# EasyEDA Pro project ProPrj_大功率电调_2026-08-17.epro, board 大功率电调V1.1
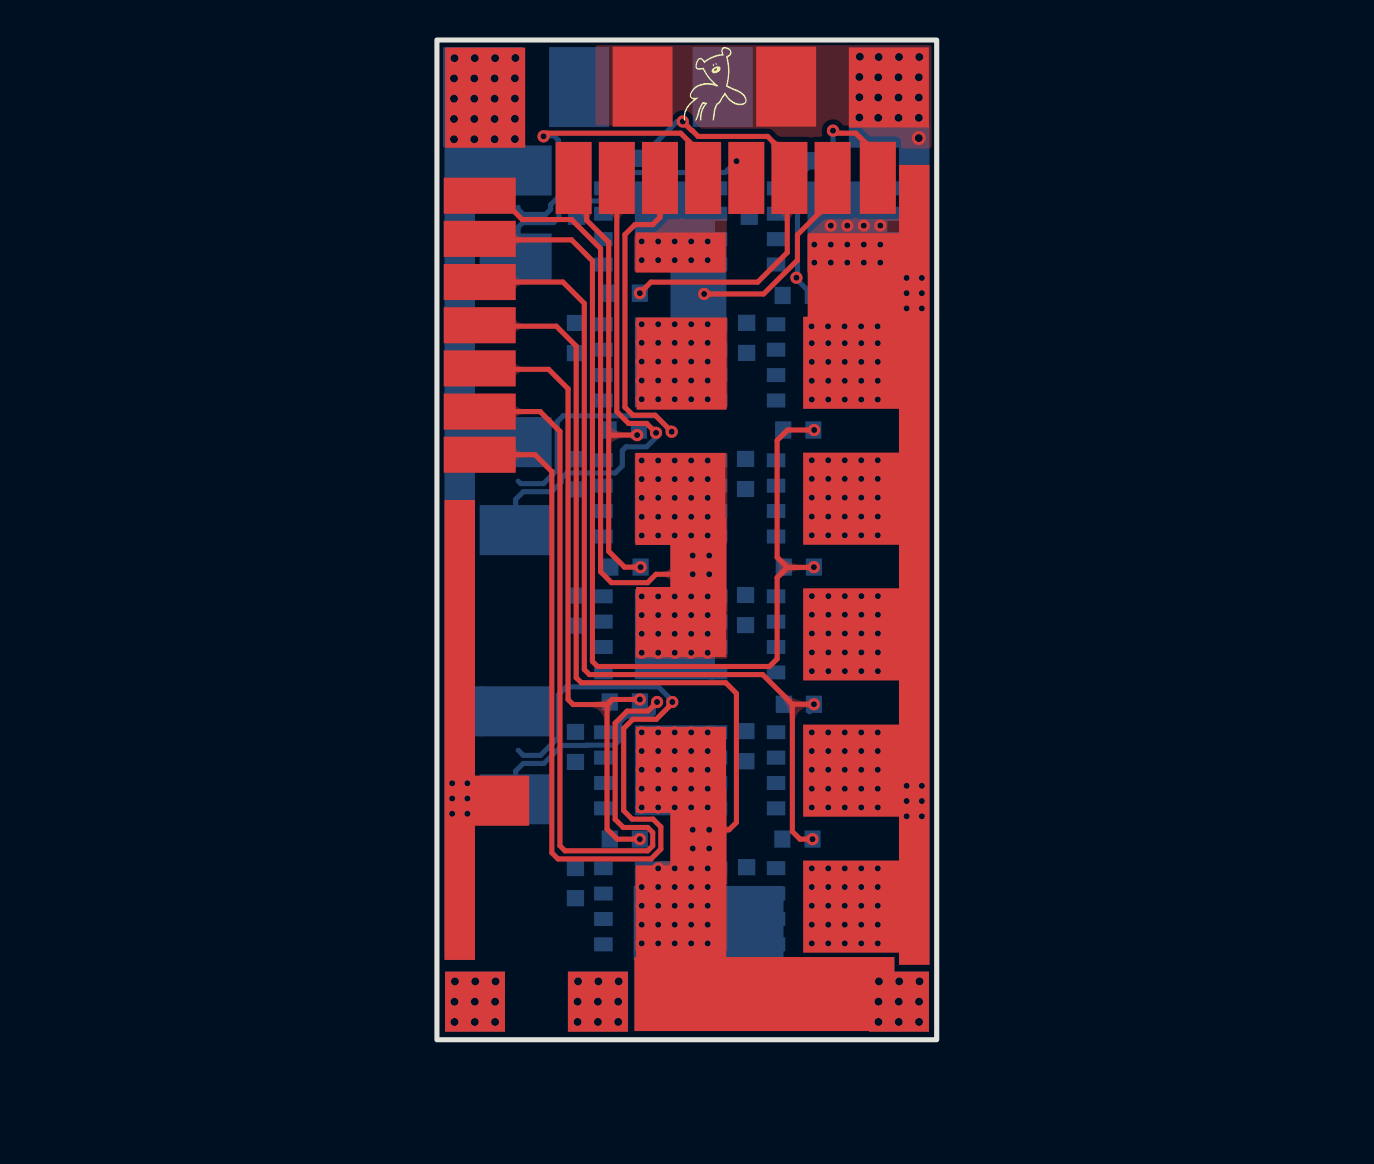
[diagram p19: board, top side]
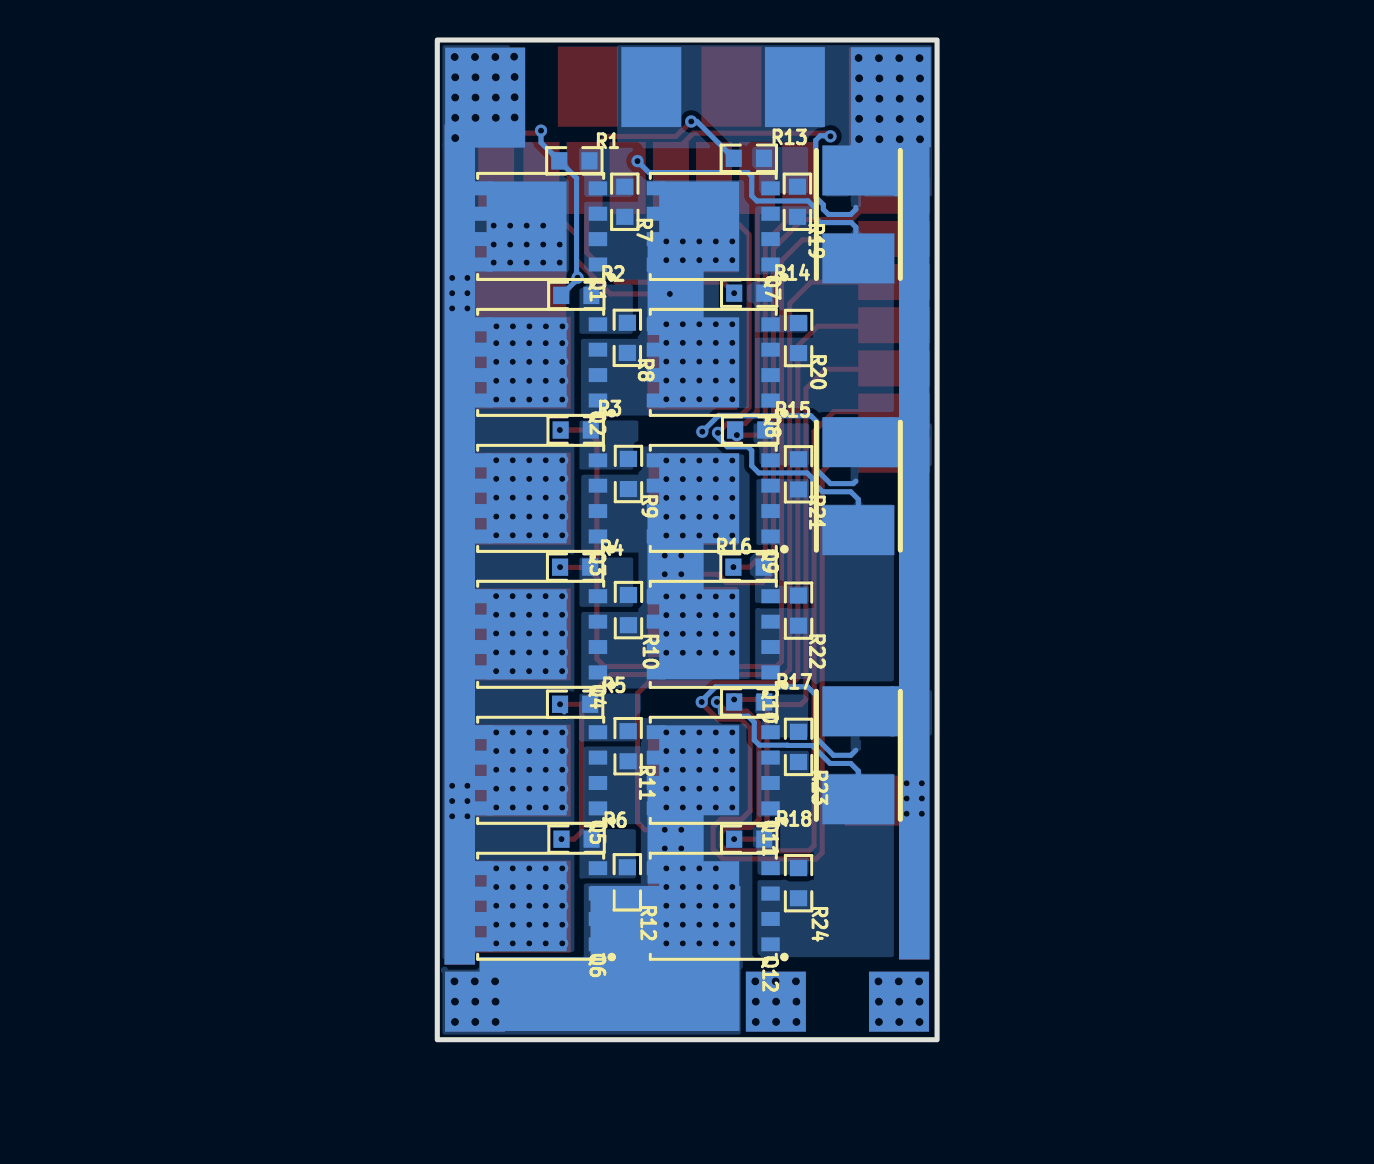
[diagram p20: board, bottom side, seen from below]

Outline 25 x 50 mm; copper layers: Top Layer, Inner1, Inner2, Inner3, Inner4, Bottom Layer. Coordinates in mm from the lower left corner of the outline.
Outline path: rectangle 0,50 25,0
Stack: Top Layer 0.035mm Outer layer thickness 1oz / Dielectric1 0.0994mm 3313 RC57% 4.2mil / Inner1 0.0152mm Inner layer thickness / Dielectric2 0.55mm 0.55mm H/H No copper / Inner2 0.0152mm Inner layer thickness / Dielectric3 0.1088mm 2116 RC54% 4.9mil / Inner3 0.0152mm Inner layer thickness / Dielectric4 0.55mm 0.55mm H/H No copper / Inner4 0.0152mm Inner layer thickness / Dielectric5 0.0994mm 3313 RC57% 4.2mil / Bottom Layer 0.035mm Outer layer thickness 1oz

## Design rules (mm)
spacing copperThickness1oz (default): track to track 0.152, other pairs 0.152 to 0.3
spacing copperThickness2oz: track to track 0.203, other pairs 0.152 to 0.3
track width copperThickness1oz (default): min 0.127, default 0.254, max 2.54
track width copperThickness2oz: min 0.203, default 0.254, max 2.54
differential pair differentialPair (default): width min 0.127, default 0.254, max 2.54; gap min 0.152, default 0.152
net GND uses copperRegion
net VCC_BUS uses copperRegion
net U uses copperRegion
net V uses copperRegion
net GHA uses copperRegion
net SNB uses copperRegion

## Placement (name value [footprint] x y rotation side)
CN7  电源正  [单焊盘_贴片_矩形_2X2_1脚#2]  22.61 47.12 180 bottom
CN8  电源负  [单焊盘_贴片_矩形_2X2_1脚#2]  2.31 47.14 180 bottom
CN9  母线电容正  [单焊盘_贴片_矩形_2X2_1脚]  10.29 47.67 0 top
CN10  母线电容正  [单焊盘_贴片_矩形_2X2_1脚]  17.47 47.67 0 top
CN11  母线电容负  [单焊盘_贴片_矩形_2X2_1脚]  7.11 47.64 180 bottom
CN12  母线电容负  [单焊盘_贴片_矩形_2X2_1脚]  14.3 47.64 180 bottom
NOREF  -  [Pad_e303]  17.63 43.1 270 top
NOREF#2  -  [Pad_e905]  13.08 23.75 180 top
NOREF#3  -  [Pad_e783]  2.41 47.12 180 top
NOREF#4  -  [Pad_e306]  11.16 43.1 270 top
NOREF#5  -  [Pad_e316]  20.9 37.23 180 top
NOREF#6  -  [Pad_e758]  12.22 20.89 180 top
NOREF#7  -  [Pad_e314]  2.14 31.42 180 top
NOREF#8  -  [Pad_e766]  20.72 27.06 180 top
NOREF#9  -  [Pad_e102]  1.14 25.02 0 top
NOREF#10  -  [Pad_e106]  8.06 1.91 0 top
NOREF#11  -  [Pad_e832]  2.14 29.88 0 top
NOREF#12  -  [Pad_e594]  1.14 15.49 0 top
NOREF#13  -  [Pad_e767]  20.72 20.27 180 top
NOREF#14  -  [Pad_e881]  16.38 2.29 90 top
NOREF#15  -  [Pad_e780]  1.91 1.91 180 top
NOREF#16  -  [Pad_e107]  23.11 1.91 0 top
NOREF#17  -  [Pad_e908]  13.08 37.59 180 top
NOREF#18  -  [Pad_e759]  12.19 39.37 180 top
NOREF#19  -  [Pad_e906]  13.08 24.13 180 top
NOREF#20  -  [Pad_e831]  1.91 43.43 0 top
NOREF#21  -  [Pad_e907]  13.08 10.16 180 top
NOREF#22  -  [Pad_e882]  13.08 10.16 180 top
NOREF#23  -  [Pad_e304]  15.48 43.1 270 top
NOREF#24  -  [Pad_e301]  22.06 43.11 270 top
NOREF#25  -  [Pad_e781]  8.05 1.91 180 top
NOREF#26  -  [Pad_e308]  6.84 43.1 270 top
NOREF#27  -  [Pad_e305]  13.32 43.1 270 top
NOREF#28  -  [Pad_e782]  23.11 1.91 180 top
NOREF#29  -  [Pad_e769]  20.72 6.66 180 top
NOREF#30  -  [Pad_e784]  22.61 47.62 180 top
NOREF#31  -  [Pad_e307]  9 43.1 270 top
NOREF#32  -  [Pad_e756]  12.22 6.42 180 top
NOREF#33  -  [Pad_e313]  2.14 33.58 180 top
NOREF#34  -  [Pad_e253]  23.88 24.77 0 top
NOREF#35  -  [Pad_e312]  2.14 35.73 180 top
NOREF#36  -  [Pad_e741]  12.21 13.5 180 top
NOREF#37  -  [Pad_e315]  2.14 29.26 180 top
NOREF#38  -  [Pad_e748]  12.24 33.81 180 top
NOREF#39  -  [Pad_e747]  12.18 27.05 180 top
NOREF#40  -  [Pad_e833]  2.08 16.42 0 top
NOREF#41  -  [Pad_e310]  2.14 40.05 180 top
NOREF#42  -  [Pad_e770]  20.85 39.34 180 top
NOREF#43  -  [Pad_e317]  2.61 11.96 0 top
NOREF#44  -  [Pad_e765]  20.72 33.86 180 top
NOREF#45  -  [Pad_e768]  20.72 13.46 180 top
NOREF#46  -  [Pad_e105]  1.91 1.91 0 top
NOREF#47  -  [Pad_e311]  2.14 37.89 180 top
NOREF#48  -  [Pad_e302]  19.79 43.1 270 top
NOREF#49  -  [Pad_e835]  13.59 5.84 90 top
NOREF#50  -  [Pad_e834]  16.38 2.29 90 top
NOREF#51  -  [Pad_e601]  23.88 23.75 0 top
NOREF#52  -  [Pad_e309]  2.14 42.21 180 top
Q1  BSC035N10NS5  [PG-TDSON-8_L5.2-W5.9-P1.27-LS6.2-BL-EP]  19.83 40.67 90 bottom
Q2  BSC035N10NS5  [PG-TDSON-8_L5.2-W5.9-P1.27-LS6.2-BL-EP]  19.83 33.88 90 bottom
Q3  BSC035N10NS5  [PG-TDSON-8_L5.2-W5.9-P1.27-LS6.2-BL-EP]  19.83 27.08 90 bottom
Q4  BSC035N10NS5  [PG-TDSON-8_L5.2-W5.9-P1.27-LS6.2-BL-EP]  19.83 20.28 90 bottom
Q5  BSC035N10NS5  [PG-TDSON-8_L5.2-W5.9-P1.27-LS6.2-BL-EP]  19.83 13.48 90 bottom
Q6  BSC035N10NS5  [PG-TDSON-8_L5.2-W5.9-P1.27-LS6.2-BL-EP]  19.83 6.68 90 bottom
Q7  BSC035N10NS5  [PG-TDSON-8_L5.2-W5.9-P1.27-LS6.2-BL-EP]  11.19 40.67 90 bottom
Q8  BSC035N10NS5  [PG-TDSON-8_L5.2-W5.9-P1.27-LS6.2-BL-EP]  11.19 33.88 90 bottom
Q9  BSC035N10NS5  [PG-TDSON-8_L5.2-W5.9-P1.27-LS6.2-BL-EP]  11.19 27.08 90 bottom
Q10  BSC035N10NS5  [PG-TDSON-8_L5.2-W5.9-P1.27-LS6.2-BL-EP]  11.19 20.28 90 bottom
Q11  BSC035N10NS5  [PG-TDSON-8_L5.2-W5.9-P1.27-LS6.2-BL-EP]  11.19 13.48 90 bottom
Q12  BSC035N10NS5  [PG-TDSON-8_L5.2-W5.9-P1.27-LS6.2-BL-EP]  11.19 6.68 90 bottom
R1  10  [R0603]  18.15 43.96 0 bottom
R2  10  [R0603]  18.05 37.22 0 bottom
R3  10  [R0603]  18.08 30.49 0 bottom
R4  10  [R0603]  18.1 23.64 0 bottom
R5  10  [R0603]  18.11 16.78 0 bottom
R6  10  [R0603]  18.03 10.03 0 bottom
R7  10K  [R0603]  15.62 41.91 90 bottom
R8  10K  [R0603]  15.49 35.1 90 bottom
R9  10K  [R0603]  15.44 28.3 90 bottom
R10  10K  [R0603]  15.44 21.49 90 bottom
R11  10K  [R0603]  15.45 14.68 90 bottom
R12  10K  [R0603]  15.49 7.87 90 bottom
R13  10  [R0603]  9.42 44.08 0 bottom
R14  10  [R0603]  9.4 37.34 0 bottom
R15  10  [R0603]  9.35 30.49 0 bottom
R16  10  [R0603]  9.43 23.64 0 bottom
R17  10  [R0603]  9.4 16.89 0 bottom
R18  10  [R0603]  9.4 10.03 0 bottom
R19  10K  [R0603]  6.99 41.91 90 bottom
R20  10K  [R0603]  6.93 35.09 90 bottom
R21  10K  [R0603]  6.93 28.28 90 bottom
R22  10K  [R0603]  6.93 21.46 90 bottom
R23  10K  [R0603]  6.93 14.65 90 bottom
R24  10K  [R0603]  6.93 7.83 90 bottom
R25  0.5mΩ  [RES-SMD_L6.4-W3.2_RLP25]  3.94 27.69 270 bottom
R26  0.5mΩ  [RES-SMD_L6.4-W3.2_RLP25]  3.94 14.22 270 bottom
R28  0.5mΩ  [RES-SMD_L6.4-W3.2_RLP25]  3.94 41.28 270 bottom

## Footprints (pads in the part's own frame, mm; a bottom-side part is the same pattern mirrored in y, then rotated)
Pad_e102
  rect 1.524x42 smd far side: 1(0,0)
Pad_e105
  rect 3x3 smd far side: 1(0,0)
Pad_e106
  rect 3x3 smd far side: 1(0,0)
Pad_e107
  rect 3x3 smd far side: 1(0,0)
Pad_e253
  rect 1.524x42 smd far side: 1(0,0)
Pad_e301
  rect 3.6x1.8 smd: 1(0,0)
Pad_e302
  rect 3.6x1.8 smd: 1(0,0)
Pad_e303
  rect 3.6x1.8 smd: 1(0,0)
Pad_e304
  rect 3.6x1.8 smd: 1(0,0)
Pad_e305
  rect 3.6x1.8 smd: 1(0,0)
Pad_e306
  rect 3.6x1.8 smd: 1(0,0)
Pad_e307
  rect 3.6x1.8 smd: 1(0,0)
Pad_e308
  rect 3.6x1.8 smd: 1(0,0)
Pad_e309
  rect 3.6x1.8 smd: 1(0,0)
Pad_e310
  rect 3.6x1.8 smd: 1(0,0)
Pad_e311
  rect 3.6x1.8 smd: 1(0,0)
Pad_e312
  rect 3.6x1.8 smd: 1(0,0)
Pad_e313
  rect 3.6x1.8 smd: 1(0,0)
Pad_e314
  rect 3.6x1.8 smd: 1(0,0)
Pad_e315
  rect 3.6x1.8 smd: 1(0,0)
Pad_e316
  rect 4.7x2.5 smd: 1(0,0)
Pad_e317
  rect 4x2.5 smd: 1(0,0)
Pad_e594
  rect 1.524x23 smd: 1(0,0)
Pad_e601
  rect 1.524x40 smd: 1(0,0)
Pad_e741
  rect 4.5x4.3 smd: 1(0,0)
Pad_e747
  rect 4.5x4.6 smd: 1(0,0)
Pad_e748
  rect 4.5x4.6 smd: 1(0,0)
Pad_e756
  rect 4.5x4.6 smd: 1(0,0)
Pad_e758
  rect 4.5x3.5 smd: 1(0,0)
Pad_e759
  rect 4.5x2 smd: 1(0,0)
Pad_e765
  rect 4.8x4.6 smd: 1(0,0)
Pad_e766
  rect 4.8x4.6 smd: 1(0,0)
Pad_e767
  rect 4.8x4.6 smd: 1(0,0)
Pad_e768
  rect 4.8x4.6 smd: 1(0,0)
Pad_e769
  rect 4.8x4.6 smd: 1(0,0)
Pad_e770
  rect 4.6x2 smd: 1(0,0)
Pad_e780
  rect 3x3 smd: 1(0,0)
Pad_e781
  rect 3x3 smd: 1(0,0)
Pad_e782
  rect 3x3 smd: 1(0,0)
Pad_e783
  rect 4x5 smd: 1(0,0)
Pad_e784
  rect 4x4 smd: 1(0,0)
Pad_e831
  rect 0.5x2.5 smd far side: 1(0,0)
Pad_e832
  rect 0.5x2.5 smd far side: 1(0,0)
Pad_e833
  rect 0.5x2.5 smd far side: 1(0,0)
Pad_e834
  rect 3.7x13 smd far side: 1(0,0)
Pad_e835
  rect 3.7x7.5 smd far side: 1(0,0)
Pad_e881
  rect 3.7x13 smd: 1(0,0)
Pad_e882
  rect 2.8x4.7 smd: 1(0,0)
Pad_e905
  rect 2.8x4.7 smd: 1(0,0)
Pad_e906
  rect 2.8x4.7 smd far side: 1(0,0)
Pad_e907
  rect 2.8x4.7 smd far side: 1(0,0)
Pad_e908
  rect 2.8x4.7 smd far side: 1(0,0)
PG-TDSON-8_L5.2-W5.9-P1.27-LS6.2-BL-EP
  rect 0.7x0.925 smd: 1(-1.905,-2.865) 2(-0.635,-2.865) 3(0.635,-2.865) 4(1.905,-2.865) 5(1.905,2.865) 6(0.635,2.865) 7(-0.635,2.865) 8(-1.905,2.865)
  rect 4.5x4 smd: 9(0.001,0.705)
R0603
  rect 0.806x0.864 smd: 1(-0.753,0) 2(0.753,0)
RES-SMD_L6.4-W3.2_RLP25
  rect 2.5x3.6 smd: 1(-2.2,0) 2(2.2,0)
单焊盘_贴片_矩形_2X2_1脚
  rect 3x4 smd: 1(0,0)
单焊盘_贴片_矩形_2X2_1脚#2
  rect 4x5 smd: 1(0,0)

## Nets
GND: CN8.1 CN11.1 CN12.1 NOREF#3.1 NOREF#9.1 NOREF#11.1 NOREF#12.1 NOREF#20.1 NOREF#40.1 NOREF#43.1 R25.1 R26.1 R28.1
VCC_BUS: CN7.1 CN9.1 CN10.1 NOREF#5.1 NOREF#8.1 NOREF#13.1 NOREF#29.1 NOREF#30.1 NOREF#34.1 NOREF#42.1 NOREF#44.1 NOREF#45.1 NOREF#51.1 Q1.5 Q1.6 Q1.7 Q1.8 Q1.9 Q2.5 Q2.6 Q2.7 Q2.8 Q2.9 Q3.5 Q3.6 Q3.7 Q3.8 Q3.9 Q4.5 Q4.6 Q4.7 Q4.8 Q4.9 Q5.5 Q5.6 Q5.7 Q5.8 Q5.9 Q6.5 Q6.6 Q6.7 Q6.8 Q6.9
GHA: NOREF#24.1 R1.2 R2.2
GHB: NOREF#41.1 R3.2 R4.2
GHC: NOREF#47.1 R5.2 R6.2
GLA: NOREF.1 R13.2 R14.2
GLB: NOREF#26.1 R15.2 R16.2
GLC: NOREF#33.1 R17.2 R18.2
SNA: NOREF#27.1
SNB: NOREF#4.1
SNC: NOREF#37.1
SPA: NOREF#23.1 Q7.1 Q7.2 Q7.3 Q8.1 Q8.2 Q8.3 R19.1 R20.1 R28.2
SPB: NOREF#31.1 Q9.1 Q9.2 Q9.3 Q10.1 Q10.2 Q10.3 R21.1 R22.1 R25.2
SPC: NOREF#7.1 Q11.1 Q11.2 Q11.3 Q12.1 Q12.2 Q12.3 R23.1 R24.1 R26.2
U: NOREF#15.1 NOREF#17.1 NOREF#18.1 NOREF#38.1 NOREF#46.1 NOREF#48.1 Q1.1 Q1.2 Q1.3 Q2.1 Q2.2 Q2.3 Q7.5 Q7.6 Q7.7 Q7.8 Q7.9 Q8.5 Q8.6 Q8.7 Q8.8 Q8.9 R7.1 R8.1
V: NOREF#2.1 NOREF#6.1 NOREF#10.1 NOREF#19.1 NOREF#25.1 NOREF#39.1 NOREF#52.1 Q3.1 Q3.2 Q3.3 Q4.1 Q4.2 Q4.3 Q9.5 Q9.6 Q9.7 Q9.8 Q9.9 Q10.5 Q10.6 Q10.7 Q10.8 Q10.9 R9.1 R10.1
W: NOREF#14.1 NOREF#16.1 NOREF#21.1 NOREF#22.1 NOREF#28.1 NOREF#32.1 NOREF#35.1 NOREF#36.1 NOREF#49.1 NOREF#50.1 Q5.1 Q5.2 Q5.3 Q6.1 Q6.2 Q6.3 Q11.5 Q11.6 Q11.7 Q11.8 Q11.9 Q12.5 Q12.6 Q12.7 Q12.8 Q12.9 R11.1 R12.1
$1N249: Q1.4 R1.1 R7.2
$1N251: Q2.4 R2.1 R8.2
$1N253: Q7.4 R13.1 R19.2
$1N255: Q8.4 R14.1 R20.2
$1N257: Q9.4 R15.1 R21.2
$1N259: Q3.4 R3.1 R9.2
$1N261: Q10.4 R16.1 R22.2
$1N263: Q4.4 R4.1 R10.2
$1N265: Q11.4 R17.1 R23.2
$1N267: Q5.4 R5.1 R11.2
$1N269: Q12.4 R18.1 R24.2
$1N271: Q6.4 R6.1 R12.2

## Via types
v1: diameter 0.7, hole 0.4, Top Layer to Bottom Layer, 64 vias
v2: diameter 0.61, hole 0.305, Top Layer to Bottom Layer, 313 vias

## Routing (per net, layer and track width the routed paths; a pad name or vN(x,y) marks a point on that pad's centre or on a via; arc(x,y) is an arc through that point)
GND:
  vias: v1(0.88,49.09) v1(0.85,48.08) v1(0.85,47.06) v1(0.85,46.05) v1(0.85,45.04) v1(1.89,49.09) v1(1.87,48.08) v1(1.87,47.06) v1(1.87,46.05) v1(1.87,45.04) v1(2.91,49.09) v1(2.88,48.08) v1(2.88,47.06) v1(2.88,46.05) v1(2.88,45.04) v1(3.92,49.1) v1(3.9,48.09) v1(3.9,47.07) v1(3.9,46.06) v1(3.9,45.04) v2(0.76,12.83) v2(0.76,12.06) v2(0.76,11.3) v2(1.52,12.83) v2(1.52,12.06) v2(1.52,11.3)
VCC_BUS:
  vias: v1(21.13,48.15) v1(21.13,47.14) v1(21.13,46.12) v1(21.16,49.16) v1(22.1,49.15) v1(22.07,48.14) v1(22.07,47.12) v1(22.07,46.11) v1(23.11,49.15) v1(23.09,48.14) v1(23.09,47.12) v1(23.09,46.11) v1(24.13,49.15) v1(24.11,48.14) v1(24.11,47.12) v1(24.11,46.11) v1(24.11,45.09) v2(18.74,35.68) v2(18.75,34.84) v2(18.75,33.9) v2(18.75,32.95) v2(18.75,32.02) v2(18.75,28.98) v2(18.75,28.05) v2(18.75,27.11) v2(18.75,26.17) v2(18.75,25.23) v2(18.76,22.19) v2(18.76,21.26) v2(18.76,20.32) v2(18.76,19.37) v2(18.76,18.43) v2(18.75,15.37) v2(18.75,14.44) v2(18.75,13.5) v2(18.75,12.55) v2(18.75,11.62) v2(18.75,8.57) v2(18.75,7.64) v2(18.75,6.7) v2(18.75,5.75) v2(18.75,4.82) v2(18.88,39.77) v2(18.88,38.87) v2(19.57,35.68) v2(19.58,34.84) v2(19.58,33.9) v2(19.58,32.95) v2(19.58,32.02) v2(19.58,28.98) v2(19.58,28.05) v2(19.58,27.11) v2(19.58,26.17) v2(19.58,25.23) v2(19.58,22.19) v2(19.58,21.26) v2(19.58,20.32) v2(19.58,19.37) v2(19.58,18.43) v2(19.58,15.37) v2(19.58,14.44) v2(19.58,13.5) v2(19.58,12.55) v2(19.58,11.62) v2(19.58,8.57) v2(19.58,7.64) v2(19.58,6.7) v2(19.58,5.75) v2(19.58,4.82) v2(19.7,40.72) v2(19.7,39.77) v2(19.7,38.87) v2(20.39,35.68) v2(20.4,34.84) v2(20.4,33.9) v2(20.4,32.95) v2(20.4,32.02) v2(20.4,28.98) v2(20.4,28.05) v2(20.4,27.11) v2(20.4,26.17) v2(20.4,25.23) v2(20.41,22.19) v2(20.41,21.26) v2(20.41,20.32) v2(20.41,19.37) v2(20.41,18.43) v2(20.4,15.37) v2(20.4,14.44) v2(20.4,13.5) v2(20.4,12.55) v2(20.4,11.62) v2(20.4,8.57) v2(20.4,7.64) v2(20.4,6.7) v2(20.4,5.75) v2(20.4,4.82) v2(20.53,40.72) v2(20.53,39.77) v2(20.53,38.87) v2(21.22,35.68) v2(21.23,34.84) v2(21.23,33.9) v2(21.23,32.95) v2(21.23,32.02) v2(21.23,28.98) v2(21.23,28.05) v2(21.23,27.11) v2(21.23,26.17) v2(21.23,25.23) v2(21.23,22.19) v2(21.23,21.26) v2(21.23,20.32) v2(21.23,19.37) v2(21.23,18.43) v2(21.23,15.37) v2(21.23,14.44) v2(21.23,13.5) v2(21.23,12.55) v2(21.23,11.62) v2(21.23,8.57) v2(21.23,7.64) v2(21.23,6.7) v2(21.23,5.75) v2(21.23,4.82) v2(21.35,40.72) v2(21.35,39.77) v2(21.35,38.87) v2(22.04,35.68) v2(22.05,34.84) v2(22.05,33.9) v2(22.05,32.95) v2(22.05,32.02) v2(22.05,28.98) v2(22.05,28.05) v2(22.05,27.11) v2(22.05,26.17) v2(22.05,25.23) v2(22.06,22.19) v2(22.06,21.26) v2(22.06,20.32) v2(22.06,19.37) v2(22.06,18.43) v2(22.05,15.37) v2(22.05,14.44) v2(22.05,13.5) v2(22.05,12.55) v2(22.05,11.62) v2(22.05,8.57) v2(22.05,7.64) v2(22.05,6.7) v2(22.05,5.75) v2(22.05,4.82) v2(22.18,40.72) v2(22.18,39.77) v2(22.18,38.87) v2(23.5,38.1) v2(23.5,37.34) v2(23.5,36.58) v2(23.5,12.7) v2(23.5,11.94) v2(23.5,11.18) v2(24.26,38.1) v2(24.26,37.34) v2(24.26,36.58) v2(24.26,12.7) v2(24.26,11.94) v2(24.26,11.18)
GHA: length 13.2
  Top Layer w0.254: NOREF#24.1 22.06,44.24 20.96,45.34 19.94,45.34 v2(19.81,45.47)
  Bottom Layer w0.254: v2(19.81,45.47) 19.81,44.87 R1.2 18.03,43.09 18.03,38.16 v2(17.98,38.11) 17.98,38.04 R2.2
GHB: length 50.4
  Top Layer w0.254: 17.53,23.62 17.02,23.11 17.02,19.05 16.64,18.67 8.03,18.67 7.78,18.92 7.78,38.96 6.73,40 2.19,40 NOREF#41.1 ; 17.53,23.62 18.84,23.62 v2(18.86,23.64) ; 17.53,23.62 17.02,24.13 17.02,29.97 17.54,30.49 v2(18.87,30.49)
GHC: length 44.2
  Top Layer w0.254: 17.78,16.78 16.3,18.26 7.63,18.26 7.37,18.52 7.37,36.82 6.3,37.89 NOREF#47.1 ; 17.78,16.78 v2(18.86,16.78) ; 17.78,16.78 17.78,10.41 18.16,10.03 v2(18.79,10.03)
  Bottom Layer w0.254: 18.8,16.81 18.65,16.67 18.65,16.4
GLA: length 22
  Top Layer w0.254: v2(12.3,45.92) 12.75,45.47 12.78,45.47 13.06,45.18 16.54,45.18 17.63,44.09 NOREF.1 17.53,42.99 17.53,39.37 16.05,37.89 10.7,37.89 v2(10.15,37.34)
  Bottom Layer w0.254: 10.17,44.08 12.01,45.92 v2(12.3,45.92)
GLB: length 22.7
  Top Layer w0.254: 8.59,30.24 8.59,39.88 7.49,40.98 7.49,42.45 NOREF#26.1 ; 8.59,30.24 8.59,24.43 9.38,23.64 v2(10.19,23.64) ; 8.59,30.24 v2(10.02,30.24)
GLC: length 32.3
  Top Layer w0.254: NOREF#33.1 2.19,33.53 5.59,33.53 6.56,32.56 6.56,17.02 6.81,16.76 8.51,16.76 ; v2(10.15,10.03) 9.02,10.03 8.51,10.54 8.51,16.76 ; 8.51,16.76 8.76,17.02 v2(10.15,17.02)
SNA: length 16
  Top Layer w0.254: v2(5.33,45.18) 5.49,45.34 12.19,45.34 13.32,44.21 NOREF#27.1
  Bottom Layer w0.254: v2(5.33,45.18) 5.36,45.21 5.84,45.21 6.07,44.98 6.07,42.14 5.69,41.76 5.69,41.53 5.44,41.28 4.32,41.28 4.06,41.53 4.06,41.63
SNB: length 26.4
  Top Layer w0.254: NOREF#4.1 11.16,41.13 10.79,40.77 9.91,40.77 9.41,40.27 9.41,31.63 9.8,31.24 10.92,31.24 v2(11.74,30.41)
  Bottom Layer w0.254: v2(11.74,30.41) 10.95,31.2 6.31,31.2 6.02,30.91 6.02,28.5 5.33,27.81 4.19,27.81 4.06,27.94
SNC: length 50.1
  Top Layer w0.254: v2(11.77,16.89) 11.6,16.71 11.6,16.65 10.97,16.03 9.8,16.03 9.34,15.57 9.34,11.46 9.76,11.03 10.81,11.03 11.2,10.64 11.2,9.53 10.71,9.04 6.05,9.04 5.75,9.35 5.75,28.42 4.91,29.26 NOREF#37.1
  Bottom Layer w0.254: v2(11.77,16.89) 11.6,17.07 11.6,17.13 11.08,17.65 6.48,17.65 6.07,17.25 6.07,15.11 5.18,14.22 4.32,14.22 4.06,14.48
SPA: length 14.8
  Bottom Layer w0.254: v2(14.99,43.94) 14.42,43.37 9.46,43.37 9.27,43.18 9.27,42.2 9.02,41.95 6.45,41.95 6.1,41.59 6.1,41.12 5.84,40.87 4.29,40.87 4.06,40.64 4.06,39.2 R28.2
SPB: length 24.7
  Top Layer w0.254: v2(10.96,30.35) 10.49,30.82 9.59,30.82 9,31.41 NOREF#31.1
  Bottom Layer w0.254: R25.2 3.94,27.03 4.32,27.41 5.73,27.41 6.22,27.9 6.22,28.07 6.5,28.35 8.92,28.35 9.27,28.7 9.27,29.46 9.46,29.66 10.49,29.66 10.96,30.12 v2(10.96,30.35)
SPC: length 50.8
  Top Layer w0.254: v2(11.01,16.89) 10.55,16.43 9.51,16.43 8.92,15.83 8.92,11.02 9.32,10.62 10.54,10.62 10.79,10.36 10.79,9.7 10.54,9.45 6.41,9.45 6.15,9.7 6.15,30.42 5.16,31.42 NOREF#7.1
  Bottom Layer w0.254: v2(11.01,16.89) 10.83,16.71 10.83,16.34 10.67,16.18 9.45,16.18 9.14,15.88 9.14,14.99 8.89,14.73 7.49,14.73 7.48,14.72 6.25,14.72 5.35,13.82 4.32,13.82 3.94,13.44 R26.2
U: length 10.2
  Top Layer w0.254: v2(13.37,37.3) 16.34,37.3 18.03,38.99 18.03,40.26 19.79,42.02 NOREF#48.1
  vias: v1(0.9,2.92) v1(0.88,1.9) v1(0.88,0.89) v1(1.92,2.92) v1(1.89,1.9) v1(1.89,0.89) v1(2.93,2.92) v1(2.91,1.9) v1(2.91,0.89) v2(10.24,39.93) v2(10.24,38.99) v2(10.24,35.78) v2(10.24,34.85) v2(10.24,33.92) v2(10.24,32.97) v2(10.24,32.03) v2(11.07,39.93) v2(11.07,38.99) v2(11.07,35.78) v2(11.07,34.85) v2(11.07,33.92) v2(11.07,32.97) v2(11.07,32.03) v2(11.89,39.93) v2(11.89,38.99) v2(11.89,35.78) v2(11.89,34.85) v2(11.89,33.92) v2(11.89,32.97) v2(11.89,32.03) v2(12.72,39.93) v2(12.72,38.99) v2(12.72,35.78) v2(12.72,34.85) v2(12.72,33.92) v2(12.72,32.97) v2(12.72,32.03) v2(13.54,39.93) v2(13.54,38.99) v2(13.54,35.78) v2(13.54,34.85) v2(13.54,33.92) v2(13.54,32.97) v2(13.54,32.03)
V: length 28.4
  Top Layer w0.254: NOREF#52.1 2.22,42.29 3,42.29 4.27,41.02 6.73,41.02 8.19,39.57 8.19,23.41 8.73,22.86 10.54,22.86 10.96,23.28 v2(12.8,23.28)
  vias: v1(7.04,1.91) v1(7.04,0.89) v1(7.06,2.92) v1(8.08,2.92) v1(8.05,1.91) v1(8.05,0.89) v1(9.09,2.92) v1(9.07,1.91) v1(9.07,0.89) v2(10.24,28.97) v2(10.24,28.04) v2(10.24,27.1) v2(10.24,26.15) v2(10.24,25.22) v2(10.24,22.17) v2(10.24,21.24) v2(10.24,20.3) v2(10.24,19.35) v2(11.07,28.97) v2(11.07,28.04) v2(11.07,27.1) v2(11.07,26.15) v2(11.07,25.22) v2(11.07,22.17) v2(11.07,21.24) v2(11.07,20.3) v2(11.07,19.35) v2(11.89,28.97) v2(11.89,28.04) v2(11.89,27.1) v2(11.89,26.15) v2(11.89,25.22) v2(11.89,22.17) v2(11.89,21.24) v2(11.89,20.3) v2(11.89,19.35) v2(12.72,28.97) v2(12.72,28.04) v2(12.72,27.1) v2(12.72,26.15) v2(12.72,25.22) v2(12.72,22.17) v2(12.72,21.24) v2(12.72,20.3) v2(12.72,19.35) v2(12.8,24.22) v2(13.54,28.97) v2(13.54,28.04) v2(13.54,27.1) v2(13.54,26.15) v2(13.54,25.22) v2(13.54,22.17) v2(13.54,21.24) v2(13.54,20.3) v2(13.54,19.35) v2(13.62,24.22) v2(13.62,23.28)
W: length 38.1
  Top Layer w0.254: v2(13.62,10.5) 14.61,10.5 14.98,10.87 14.98,17.32 14.45,17.86 7.22,17.86 6.97,18.11 6.97,34.69 5.97,35.69 2.19,35.69 NOREF#35.1
  vias: v1(22.11,2.92) v1(22.09,1.91) v1(22.09,0.89) v1(23.13,2.92) v1(23.1,1.91) v1(23.1,0.89) v1(24.14,2.92) v1(24.12,1.91) v1(24.12,0.89) v2(10.24,15.37) v2(10.24,14.44) v2(10.24,13.5) v2(10.24,12.55) v2(10.24,11.62) v2(10.24,7.64) v2(10.24,6.7) v2(10.24,5.75) v2(10.24,4.82) v2(11.07,15.37) v2(11.07,14.44) v2(11.07,13.5) v2(11.07,12.55) v2(11.07,11.62) v2(11.07,8.57) v2(11.07,7.64) v2(11.07,6.7) v2(11.07,5.75) v2(11.07,4.82) v2(11.89,15.37) v2(11.89,14.44) v2(11.89,13.5) v2(11.89,12.55) v2(11.89,11.62) v2(11.89,8.57) v2(11.89,7.64) v2(11.89,6.7) v2(11.89,5.75) v2(11.89,4.82) v2(12.72,15.37) v2(12.72,14.44) v2(12.72,13.5) v2(12.72,12.55) v2(12.72,11.62) v2(12.72,8.57) v2(12.72,7.64) v2(12.72,6.7) v2(12.72,5.75) v2(12.72,4.82) v2(12.8,10.5) v2(12.8,9.56) v2(13.54,15.37) v2(13.54,14.44) v2(13.54,13.5) v2(13.54,12.55) v2(13.54,11.62) v2(13.54,8.57) v2(13.54,7.64) v2(13.54,6.7) v2(13.54,5.75) v2(13.54,4.82) v2(13.62,9.56)

## Copper pours and planes (outline as drawn; the poured copper is in the pictures)
GND on Bottom Layer: 0.21,30.84 6.02,30.84 6.02,28.68 0.21,28.68
GND on Bottom Layer: 0.25,44.83 5.79,44.83 5.79,43.87 0.25,43.87
GND on Bottom Layer: 0,50 16,50 16,44.58 0,44.58
GND on Bottom Layer: 0.25,44.45 6.06,44.45 6.06,42.16 0.25,42.16
GND on Bottom Layer: 0.13,17.49 5.94,17.49 5.94,15.21 0.13,15.21
VCC_BUS on Top Layer: 18.4,8.92 23.17,8.92 23.17,4.39 18.4,4.39
VCC_BUS on Top Layer: 18.51,42.94 23.41,42.94 23.41,38.41 18.51,38.41
VCC_BUS on Top Layer: 18.34,15.72 23.11,15.72 23.11,11.19 18.34,11.19
VCC_BUS on Top Layer: 7.93,50 25.15,50 25.15,44.58 7.93,44.58
VCC_BUS on Top Layer: 18.38,29.33 23.28,29.33 23.28,24.79 18.38,24.79
VCC_BUS on Top Layer: 18.34,22.52 23.24,22.52 23.24,17.99 18.34,17.99
VCC_BUS on Top Layer: 18.38,36.14 23.28,36.14 23.28,31.6 18.38,31.6
VCC_BUS on Top Layer: 18.94,38.42 24.64,38.42 24.64,36.07 18.94,36.07
VCC_BUS on Bottom Layer: 21.36,50 25,50 25,44.59 21.36,44.59
VCC_BUS on Bottom Layer: 18.15,44.89 25,44.89 25,4.03 18.15,4.03
SPA on Bottom Layer: 7.96,31.15 7.88,31.24 2.08,31.24 2.08,40.29 6.34,40.29 6.33,41.69 9.09,41.69 9.09,38.27 7.9,38.27 7.89,36.48 6.22,36.48 6.22,35.11 9.14,35.11 9.14,31.24 9.06,31.15
SPB on Bottom Layer: 7.91,17.63 7.83,17.72 2.04,17.72 2.04,26.77 6.42,26.77 6.41,28.04 9.04,28.04 9.04,24.75 7.85,24.75 7.84,22.96 6.17,22.96 6.17,21.59 9.1,21.59 9.1,17.72 9.01,17.63
SPC on Bottom Layer: 7.91,4.04 7.83,4.13 2.03,4.13 2.03,13.31 6.42,13.31 6.41,14.45 9.04,14.45 9.04,11.16 7.85,11.16 7.84,9.37 6.17,9.37 6.17,8 9.09,8 9.09,4.13 9.01,4.04
U on Top Layer: 9.86,42.92 14.5,42.92 14.5,38.39 9.86,38.39
U on Top Layer: 9.91,36.12 14.55,36.12 14.55,31.59 9.91,31.59
U on Bottom Layer: 9.42,43.33 14.96,43.33 14.96,41.91 17.82,41.91 17.82,38.02 14.96,38.02 14.96,35.08 14.99,35.05 17.81,35.05 17.81,31.22 9.14,31.22 9.38,31.46 9.38,36.63 10.92,36.63 10.92,38.02 9.47,38.02 9.4,38.1 9.4,43.31
U on Inner1: 0.38,3.43 3.43,3.43 3.43,0.38 0.38,0.38
U on Inner1: 0,50 25,50 25,0 0,0
U on Inner2: 0,50 25,50 25,0 0,0
V on Top Layer: 9.89,29.36 14.53,29.36 14.53,24.83 9.89,24.83
V on Top Layer: 9.9,22.55 14.55,22.55 14.55,18.02 9.9,18.02
V on Bottom Layer: 9.4,29.67 14.94,29.67 14.94,28.26 17.8,28.26 17.8,24.37 14.94,24.37 14.94,21.42 14.97,21.4 17.8,21.4 17.8,17.57 9.13,17.57 9.36,17.81 9.36,22.98 10.9,22.98 10.9,24.37 9.46,24.37 9.38,24.45 9.38,29.65
V on Inner3: 0,50 25,50 25,0 0,0
V on Inner4: 0,50 25,50 25,0 0,0
W on Top Layer: 9.89,8.92 14.53,8.92 14.53,4.39 9.89,4.39
W on Bottom Layer: 9.71,0 9.71,4.26 17.69,4.26 17.69,3.94 25.01,3.94 25,3.54 25,0
W on Bottom Layer: 9.27,16.08 14.81,16.08 14.81,14.67 17.67,14.67 17.67,10.78 14.82,10.78 14.82,7.83 14.84,7.81 17.67,7.81 17.67,3.98 9,3.98 9.24,4.22 9.24,9.39 10.78,9.39 10.78,10.78 9.33,10.78 9.25,10.86 9.25,16.06
$1N249 on Bottom Layer: 14.96,41.91 14.99,41.93 14.99,44.58 15.03,44.62 18.15,44.62 18.15,41.91
$1N251 on Bottom Layer: 14.89,35.21 14.91,35.23 14.91,37.88 14.96,37.92 18.07,37.92 18.07,35.21
$1N253 on Bottom Layer: 6.05,41.94 6.08,41.96 6.08,44.61 6.12,44.65 9.24,44.65 9.24,41.94
$1N255 on Bottom Layer: 6.3,35.23 6.32,35.25 6.32,37.89 6.37,37.94 9.48,37.94 9.48,35.23
$1N257 on Bottom Layer: 6,28.31 6.02,28.33 6.02,30.97 6.06,31.02 9.18,31.02 9.18,28.31
$1N259 on Bottom Layer: 14.92,28.48 14.94,28.5 14.94,31.14 14.98,31.19 18.1,31.19 18.1,28.48
$1N261 on Bottom Layer: 6.18,21.62 6.2,21.64 6.2,24.29 6.25,24.33 9.36,24.33 9.36,21.62
$1N263 on Bottom Layer: 14.84,21.57 14.87,21.59 14.87,24.24 14.91,24.28 18.03,24.28 18.03,21.57
$1N265 on Bottom Layer: 5.92,14.88 5.94,14.9 5.94,17.54 5.99,17.59 9.1,17.59 9.1,14.88
$1N267 on Bottom Layer: 14.8,14.77 14.83,14.8 14.83,17.44 14.87,17.48 17.99,17.48 17.99,14.77
$1N269 on Bottom Layer: 6.03,8.04 6.05,8.07 6.05,10.71 6.09,10.75 9.21,10.75 9.21,8.04
$1N271 on Bottom Layer: 14.79,7.92 14.81,7.94 14.81,10.58 14.86,10.63 17.97,10.63 17.97,7.92

Small or netless copper shapes (teardrops, artwork), in the pictures only: 39 on Top Layer, 23 on Bottom Layer
